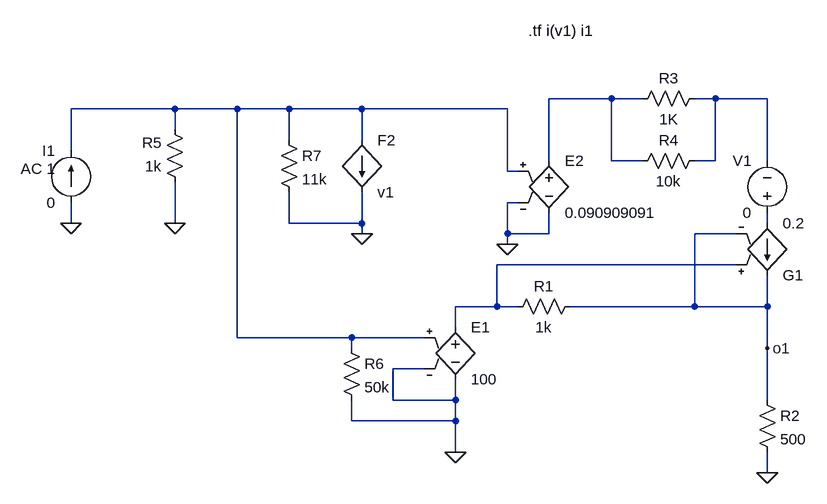
[diagram p0: schematic pruebametodo3.asc]
pruebametodo3.asc, the LTspice schematic file:
Version 4
SHEET 1 1112 1092
WIRE 480 -224 384 -224
WIRE 528 -224 480 -224
WIRE 640 -224 608 -224
WIRE 720 -224 640 -224
WIRE -192 -208 -352 -208
WIRE -96 -208 -192 -208
WIRE -16 -208 -96 -208
WIRE 96 -208 -16 -208
WIRE 320 -208 96 -208
WIRE -192 -176 -192 -208
WIRE -16 -160 -16 -208
WIRE 96 -160 96 -208
WIRE -352 -144 -352 -208
WIRE 384 -128 384 -224
WIRE 480 -128 480 -224
WIRE 528 -128 480 -128
WIRE 640 -128 640 -224
WIRE 640 -128 608 -128
WIRE 720 -128 720 -224
WIRE 320 -112 320 -208
WIRE 336 -112 320 -112
WIRE 336 -64 320 -64
WIRE -352 -32 -352 -64
WIRE -192 -32 -192 -96
WIRE -16 -32 -16 -80
WIRE 96 -32 96 -80
WIRE 96 -32 -16 -32
WIRE 720 -32 720 -48
WIRE 96 -16 96 -32
WIRE 320 -16 320 -64
WIRE 384 -16 384 -48
WIRE 384 -16 320 -16
WIRE 672 -16 608 -16
WIRE 320 0 320 -16
WIRE 672 32 304 32
WIRE 304 96 304 32
WIRE 304 96 240 96
WIRE 336 96 304 96
WIRE 608 96 608 -16
WIRE 608 96 416 96
WIRE 720 96 720 48
WIRE 720 96 608 96
WIRE 240 128 240 96
WIRE -96 144 -96 -208
WIRE 80 144 -96 144
WIRE 192 144 80 144
WIRE 80 160 80 144
WIRE 720 160 720 96
WIRE 192 192 144 192
WIRE 144 240 144 192
WIRE 240 240 240 208
WIRE 240 240 144 240
WIRE 720 240 720 160
WIRE 80 272 80 240
WIRE 240 272 240 240
WIRE 240 272 80 272
WIRE 240 320 240 272
WIRE 720 352 720 320
FLAG 240 320 0
FLAG 720 352 0
FLAG -352 -32 0
FLAG 720 160 o1
FLAG -192 -32 0
FLAG 320 0 0
FLAG 96 -16 0
SYMBOL e 240 112 R0
SYMATTR InstName E1
SYMATTR Value 100
SYMBOL res 320 112 R270
WINDOW 0 32 56 VTop 2
WINDOW 3 0 56 VBottom 2
SYMATTR InstName R1
SYMATTR Value 1k
SYMBOL g 720 64 M180
SYMATTR InstName G1
SYMATTR Value 0.2
SYMBOL res 704 224 R0
SYMATTR InstName R2
SYMATTR Value 500
SYMBOL res -176 -80 R180
WINDOW 0 36 76 Left 2
WINDOW 3 36 40 Left 2
SYMATTR InstName R5
SYMATTR Value 1k
SYMBOL res 64 144 R0
SYMATTR InstName R6
SYMATTR Value 50k
SYMBOL current -352 -64 R180
WINDOW 0 24 80 Left 2
WINDOW 3 24 0 Left 2
WINDOW 123 24 52 Left 2
WINDOW 39 0 0 Left 0
SYMATTR InstName I1
SYMATTR Value 0
SYMATTR Value2 AC 1
SYMBOL voltage 720 -32 R180
WINDOW 0 24 96 Left 2
WINDOW 3 24 16 Left 2
WINDOW 123 0 0 Left 0
WINDOW 39 0 0 Left 0
SYMATTR InstName V1
SYMATTR Value 0
SYMBOL res 624 -240 R90
WINDOW 0 0 56 VBottom 2
WINDOW 3 32 56 VTop 2
SYMATTR InstName R3
SYMATTR Value 1K
SYMBOL res 624 -144 R90
WINDOW 0 0 56 VBottom 2
WINDOW 3 32 56 VTop 2
SYMATTR InstName R4
SYMATTR Value 10k
SYMBOL e 384 -144 R0
SYMATTR InstName E2
SYMATTR Value 0.090909091
SYMBOL res -32 -176 R0
SYMATTR InstName R7
SYMATTR Value 11k
SYMBOL f 96 -160 R0
SYMATTR InstName F2
SYMATTR Value v1
SYMATTR Value2 -0.090909091
TEXT 352 -328 Left 2 !.tf i(v1) i1

The netlist it stands for:
* pruebametodo3.asc
E1 N005 0 N003 0 100
R1 N005 o1 1k
G1 N004 o1 N005 o1 0.2
R2 o1 0 500
R5 0 N003 1k
R6 N003 0 50k
I1 0 N003 0 AC 1
V1 N004 N002 0
R3 N002 N001 1K
R4 N002 N001 10k
E2 N001 0 N003 0 0.090909091
R7 N003 0 11k
F2 N003 0 v1 -0.090909091
.tf i(v1) i1
.backanno
.end